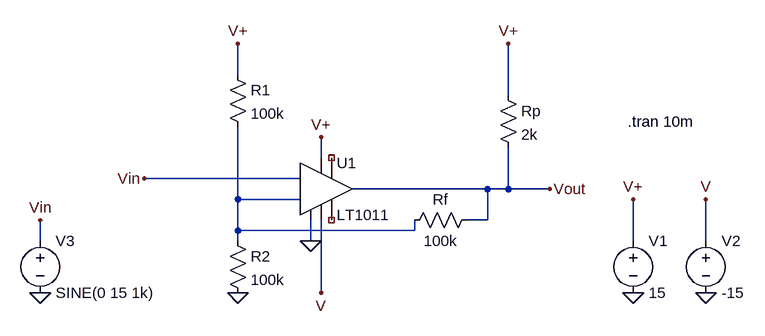
[diagram p0: schematic montage_inverseur_comparateur_2.asc]
montage_inverseur_comparateur_2.asc, the LTspice schematic file:
Version 4
SHEET 1 880 680
WIRE 64 -16 64 -64
WIRE 480 16 480 -64
WIRE 192 112 192 80
WIRE 160 144 -80 144
WIRE 448 160 240 160
WIRE 480 160 480 96
WIRE 480 160 448 160
WIRE 544 160 480 160
WIRE 64 176 64 64
WIRE 160 176 64 176
WIRE 448 208 448 160
WIRE 448 208 416 208
WIRE 64 224 64 176
WIRE 336 224 336 208
WIRE 336 224 64 224
WIRE -240 240 -240 208
WIRE 64 240 64 224
WIRE 176 240 176 208
WIRE 672 240 672 176
WIRE 784 240 784 176
WIRE 192 320 192 208
FLAG 64 320 0
FLAG 176 240 0
FLAG 480 -64 V+
FLAG 64 -64 V+
FLAG 192 80 V+
FLAG 544 160 Vout
FLAG -80 144 Vin
FLAG 192 320 V
FLAG -240 320 0
FLAG 672 320 0
FLAG 784 320 0
FLAG 784 176 V
FLAG 672 176 V+
FLAG -240 208 Vin
SYMBOL Comparators\\LT1011 192 160 R0
SYMATTR InstName U1
SYMBOL res 48 224 R0
SYMATTR InstName R2
SYMATTR Value 100k
SYMBOL res 48 -32 R0
SYMATTR InstName R1
SYMATTR Value 100k
SYMBOL voltage 672 224 R0
WINDOW 123 0 0 Left 0
WINDOW 39 0 0 Left 0
SYMATTR InstName V1
SYMATTR Value 15
SYMBOL voltage 784 224 R0
WINDOW 123 0 0 Left 0
WINDOW 39 0 0 Left 0
SYMATTR InstName V2
SYMATTR Value -15
SYMBOL voltage -240 224 R0
WINDOW 123 0 0 Left 0
WINDOW 39 0 0 Left 0
SYMATTR InstName V3
SYMATTR Value SINE(0 15 1k)
SYMBOL res 464 0 R0
SYMATTR InstName Rp
SYMATTR Value 2k
SYMBOL res 432 192 R90
WINDOW 0 0 56 VBottom 2
WINDOW 3 32 56 VTop 2
SYMATTR InstName Rf
SYMATTR Value 100k
TEXT 664 56 Left 2 !.tran 10m

The netlist it stands for:
* montage_inverseur_comparateur_2.asc
XU1 0 N001 Vin V NC_01 NC_02 Vout V+ LT1011
R2 N001 0 100k
R1 V+ N001 100k
V1 V+ 0 15
V2 V 0 -15
V3 Vin 0 SINE(0 15 1k)
Rp V+ Vout 2k
Rf Vout N001 100k
.tran 10m
.lib LTC1.lib
.backanno
.end